# EAGLE design esquematico (EAGLE 9.4.2)
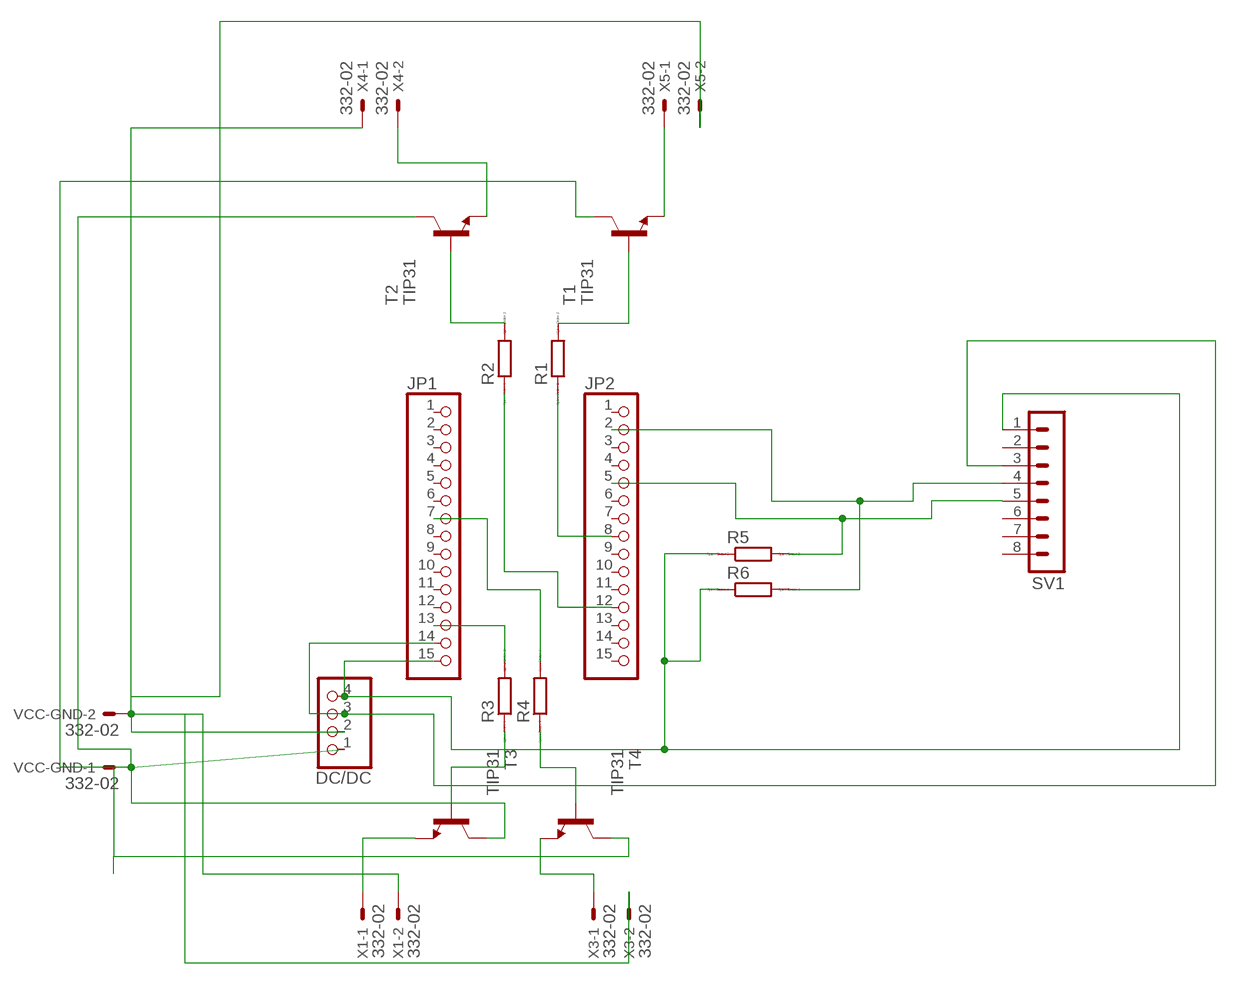
[diagram p0: schematic, sheet 1]

## Parts
DC/DC  PINHD-1X4  [1X04]
JP1  PINHD-1X15  [1X15]
JP2  PINHD-1X15  [1X15]
R1  R0207/10  [0207/10]
R2  R0207/10  [0207/10]
R3  R0207/10  [0207/10]
R4  R0207/10  [0207/10]
R5  R0207/10  [0207/10]
R6  R0207/10  [0207/10]
SV1  MA08-1  [MA08-1]
T1  TIP31  [TO220]
T2  TIP31  [TO220]
T3  TIP31  [TO220]
T4  TIP31  [TO220]
VCC-GND  332-02  [332-02]
X1  332-02  [332-02]
X3  332-02  [332-02]
X4  332-02  [332-02]
X5  332-02  [332-02]

## Nets
N$1: JP1.13 R3.2
N$2: JP2.12 R2.1
N$3: JP2.8 R1.1
N$4: R4.1 T4.1(B)
N$5: R3.1 T3.1(B)
N$6: R1.2 T1.1(B)
N$7: R2.2 T2.1(B)
N$8: T3.3(E) X1.1
N$9: JP2.2 R6.2 SV1.4
N$10: JP2.5 R5.2 SV1.5
N$11: DC/DC.4 JP1.15 R5.1 R6.1 SV1.1
N$12: DC/DC.1 T1.2(C) T2.2(C) T3.2(C) T4.2(C) VCC-GND.1
N$13: JP1.7 R4.2
N$14: DC/DC.3 JP1.14 SV1.3
N$17: DC/DC.2 VCC-GND.2 X1.2 X3.2 X4.1 X5.2
N$18: T4.3(E) X3.1
N$19: T2.3(E) X4.2
N$20: T1.3(E) X5.1
Unconnected: JP1.1 JP1.2 JP1.3 JP1.4 JP1.5 JP1.6 JP1.8 JP1.9 JP1.10 JP1.11 JP1.12 JP2.1 JP2.3 JP2.4 JP2.6 JP2.7 JP2.9 JP2.10 JP2.11 JP2.13 JP2.14 JP2.15 SV1.2 SV1.6 SV1.7 SV1.8

## Library data of the parts
DC/DC = pinhead:PINHD-1X4: PIN HEADER
JP1 JP2 = pinhead:PINHD-1X15: PIN HEADER
R1-R6 = eagle-ltspice:R: RESISTOR, European symbol; SPICEMODEL: NONE; SPICEPREFIX: R
SV1 = con-lstb:MA08-1: PIN HEADER; OC_FARNELL: unknown; OC_NEWARK: unknown
T1-T4 = transistor:TIP31: NPN Transistor Medium Power Linear Switching Applications Source: http://onsemi.com
VCC-GND X1 X3-X5 = con-garry:332-02: 2 Pin - 2mm Dual Row Source: www.mpe-connector.de / garry_shortform_2012.pdf

## Board
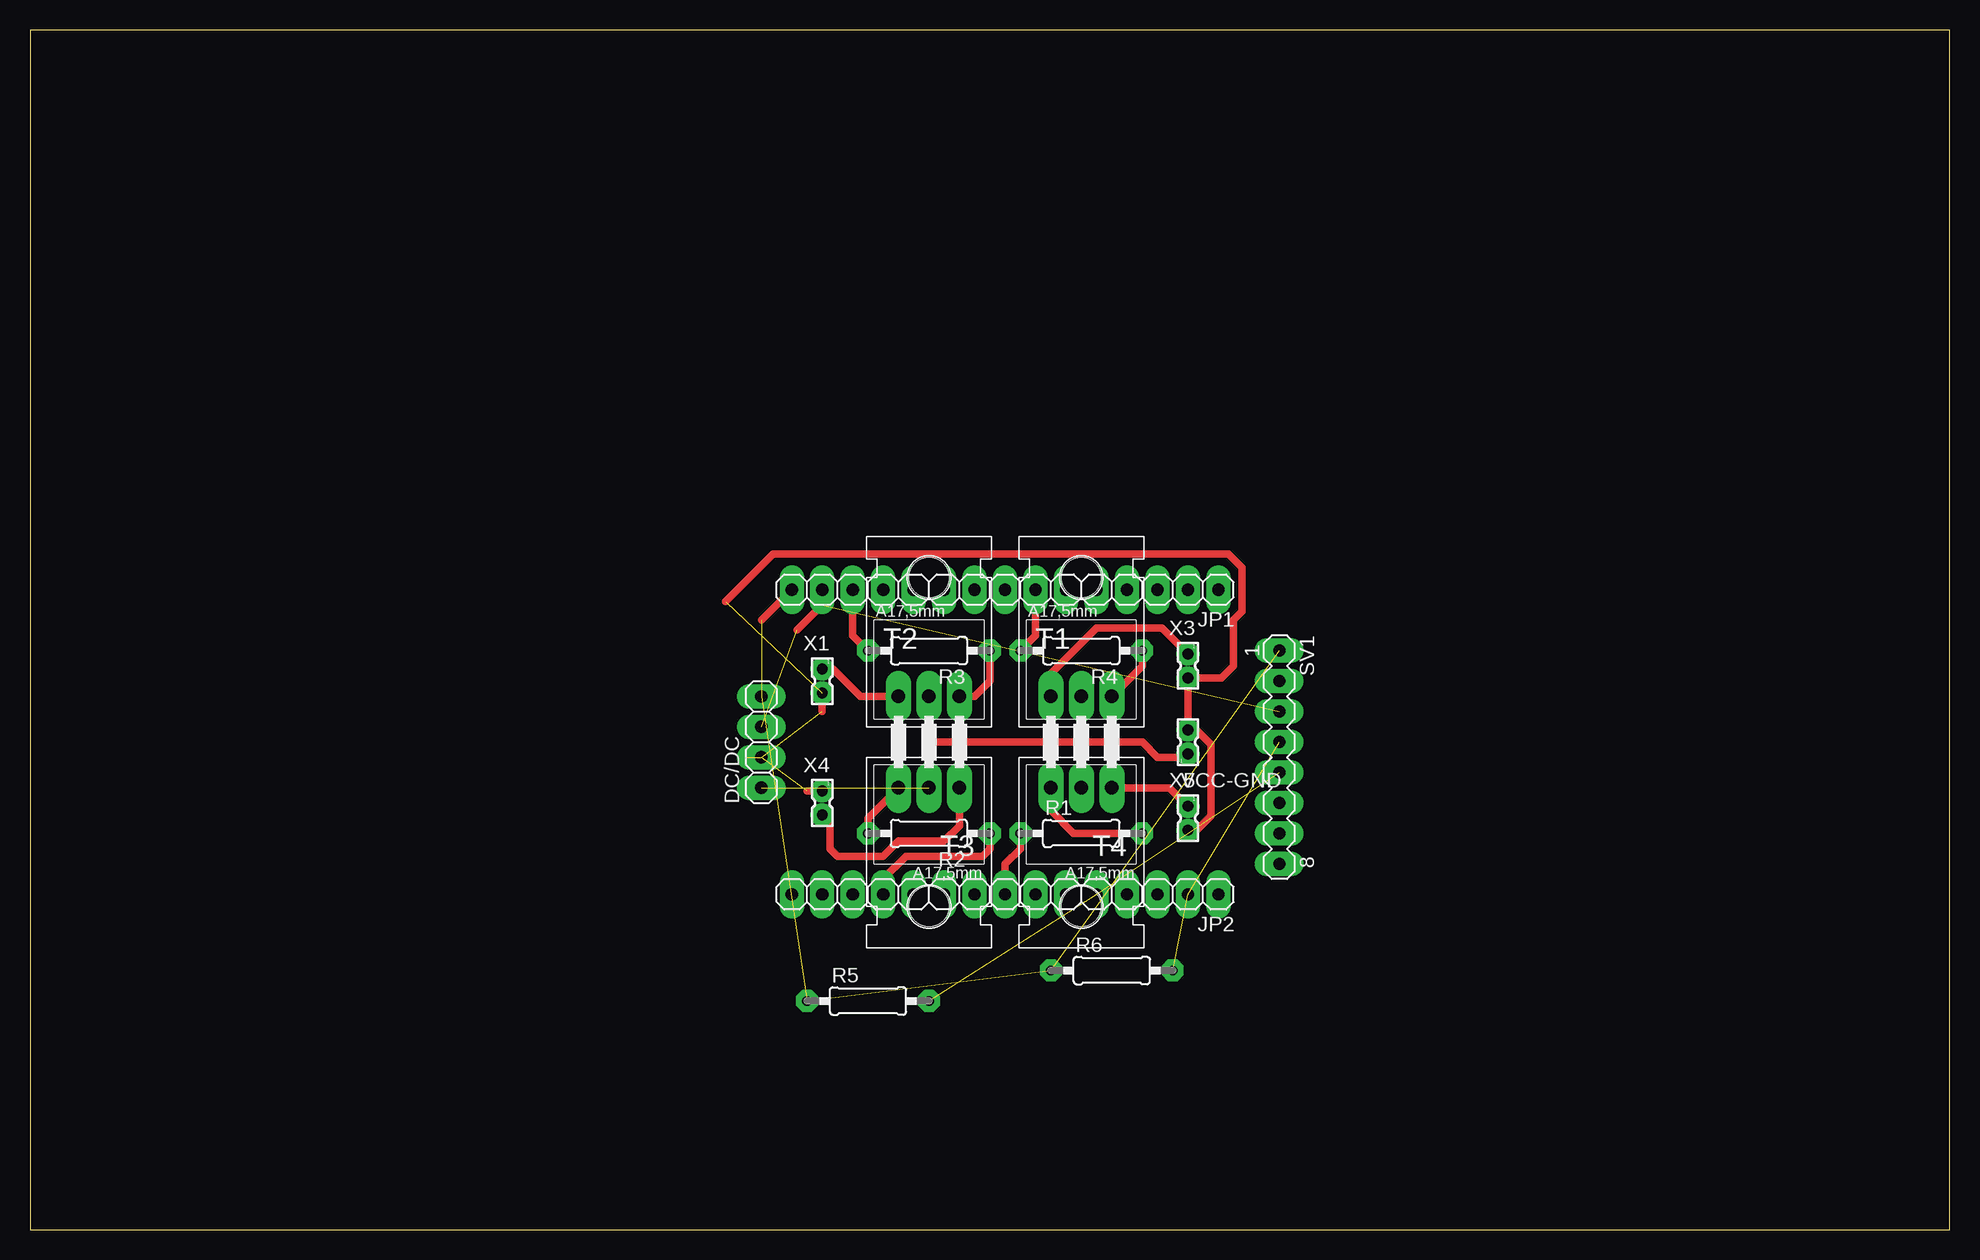
[diagram p1: board, top side]

Size 160 x 100 mm. Coordinates in mm from the lower left corner, seen from the top.
Outline: 0,0 160,0 160,100 0,100 0,0
Copper layers (1*16): Top 0.035mm / dielectric 1.5mm / Bottom 0.035mm
Design rules "default *": minimum track width 25mil, minimum drill 0.35mm, track to track 25mil, track to pad 25mil, pad to pad 25mil, via to via 25mil, smd to smd 25mil, copper to edge 25mil, drill to drill 25mil, minimum pad ring 25mil, minimum via ring 8mil, stop-mask expansion 4mil, vias tented up to drill 0mil, thermal gap 25mil

### Footprints (pad centres in the part's own frame; a part is rotated, then mirrored left to right if it is on the bottom)
1X04 = drill 1.016 long: 1 -3.81,0; 2 -1.27,0; 3 1.27,0; 4 3.81,0
1X15 = drill 1.016 long: 1 -17.78,0; 2 -15.24,0; 3 -12.7,0; 4 -10.16,0; 5 -7.62,0; 6 -5.08,0; 7 -2.54,0; 8 0,0; 9 2.54,0; 10 5.08,0; 11 7.62,0; 12 10.16,0; 13 12.7,0; 14 15.24,0; 15 17.78,0
0207/10 = drill 0.813 octagon: 1 -5.08,0; 2 5.08,0
MA08-1 = drill 1.016 long: 1 -8.89,0; 2 -6.35,0; 3 -3.81,0; 4 -1.27,0; 5 1.27,0; 6 3.81,0; 7 6.35,0; 8 8.89,0
TO220 = drill 1.118 long: 1 -2.54,-6.35; 2 0,-6.35; 3 2.54,-6.35 | hole 3.302: 0,11.176
332-02 = drill 0.9 pad 1.27: 1 0,-1; 2 0,1

### Placement (x,y rotation side)
DC/DC  60.96,40.64 90 top
JP1  81.28,53.34 180 top
JP2  81.28,27.94 180 top
R1  87.63,33.02 0 top
R2  74.93,33.02 180 top
R3  74.93,48.26 180 top
R4  87.63,48.26 180 top
R5  69.85,19.05 0 top
R6  90.17,21.59 0 top
SV1  104.14,39.37 270 top
T1  87.63,43.18 0 top
T2  74.93,43.18 0 top
T3  74.93,38.1 180 top
T4  87.63,38.1 180 top
VCC-GND  96.52,40.64 0 top
X1  66.04,45.72 180 top
X3  96.52,46.99 180 top
X4  66.04,35.56 180 top
X5  96.52,34.29 180 top

### Tracks (layer width: path | path; a pad name or v marks a point on that pad's centre or on a via)
N$1
  Top 0.635: R3.2 68.58,49.53 JP1.13
N$2
  Top 0.635: R2.1 80.01,31.75 79.38,31.11 73.03,31.11 71.12,29.21 JP2.12
N$3
  Top 0.635: R1.1 82.55,31.75 81.28,30.48 JP2.8
N$4
  Top 0.635: R4.1 92.71,46.99 T4.1
N$5
  Top 0.635: T3.1 78.74,44.45 80.01,45.72 R3.1
N$6
  Top 0.635: R1.2 87,33.02 85.09,34.92 T1.1
N$7
  Top 0.635: T2.1 69.85,34.29 R2.2
N$8
  Top 0.635: T3.3 69.22,44.45 66.94,46.72 X1.1
N$9  (2 unrouted)
N$10  (2 unrouted)
N$11  (4 unrouted)
  Top 0.635: JP1.15 60.96,50.8
N$12  (1 unrouted)
  Top 0.635: T4.2 87.63,40.64 | 87.63,40.64 T1.2 | T2.2 74.93,40.64 | VCC-GND.1 96.25,39.37 93.98,39.37 92.71,40.64 87.63,40.64 | 74.93,40.64 87.63,40.64 | T3.2 74.93,40.64
N$13
  Top 0.635: JP1.7 83.82,49.53 R4.2
N$14  (2 unrouted)
  Top 0.635: JP1.14 66.04,52.07 63.94,49.97
N$17  (4 unrouted)
  Top 0.635: 64.77,36.56 X4.1 | 66.04,43.18 X1.2 | X5.2 97.22,33.29 98.43,34.5 98.43,40.43 97.22,41.64 VCC-GND.2 X3.2 99.33,45.99 100.33,46.99 100.33,50.81 101.03,51.51 101.03,55.18 99.89,56.33 61.93,56.33 57.98,52.37 | 59.69,39.36 59.69,39.37
N$18
  Top 0.635: T4.3 85.09,46.35 88.9,50.16 94.34,50.16 X3.1 96.79,48.26 97.16,48.26
N$19
  Top 0.635: X4.2 66.67,33.92 66.67,31.75 67.31,31.11 71.12,31.11 72.39,32.38 76.2,32.38 77.47,33.66 T2.3
N$20
  Top 0.635: T1.3 94.98,36.83 X5.1